# EAGLE design main (EAGLE 9.2.2)
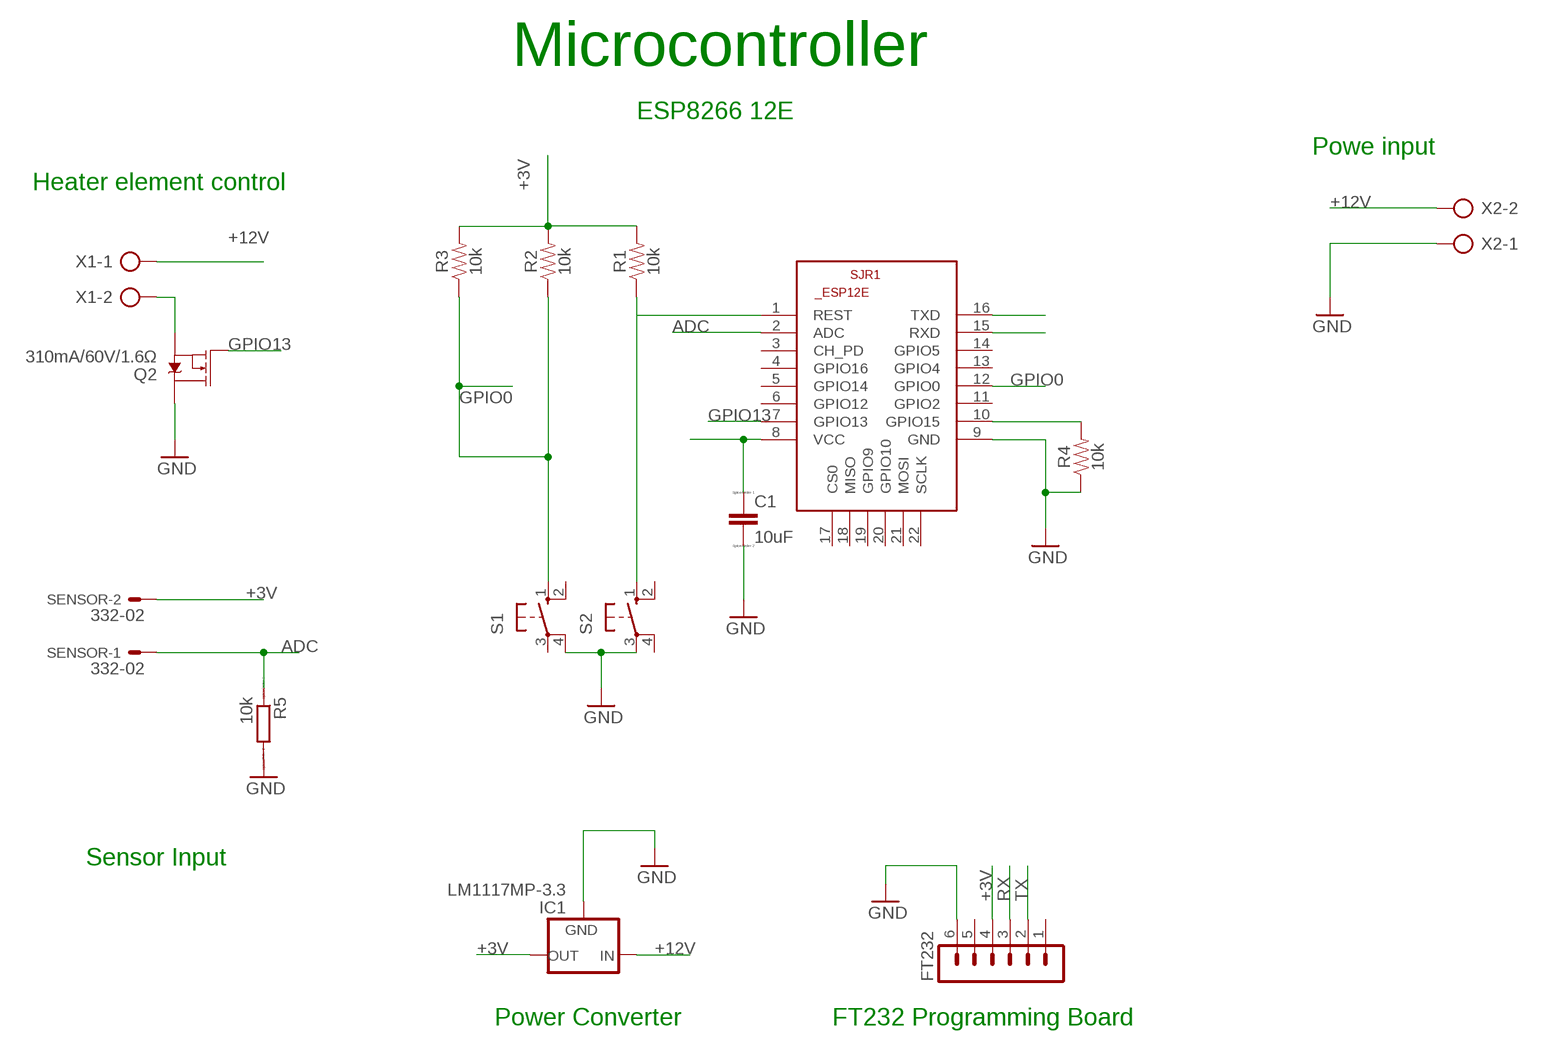
[diagram p0: schematic, sheet 1]

## Parts
C1  10uF  CC1206  [C1206]
FT232  MA06-1  [MA06-1]
IC1  LM1117MP-3.3  [SOT223]
Q2  310mA/60V/1.6Ω  MOSFET-NCH-2N7002PW  [SOT323]
R1  10k  10KOHM-0603-1/10W-1%  [0603]
R2  10k  10KOHM-0603-1/10W-1%  [0603]
R3  10k  10KOHM-0603-1/10W-1%  [0603]
R4  10k  10KOHM-0603-1/10W-1%  [0603]
R5  10k  RR1206  [R1206]
S1  10-XX  [B3F-10XX]
S2  10-XX  [B3F-10XX]
SENSOR  332-02  [332-02]
SJR1  ESP8266-12EESP12E  [ESP8266-ESP12E]
X1  AK500/2  [AK500/2]
X2  AK500/2  [AK500/2]

## Nets
+3V: C1.1 FT232.4 IC1.2(OUT) IC1.4(OUT) R1.2 R2.2 R3.2 SENSOR.2 SJR1.8(VCC)
+12V: IC1.3(IN) X1.1 X2.2
ADC: R5.1 SENSOR.1 SJR1.2(ADC)
GND: C1.2 FT232.6 IC1.1(GND) Q2.3(D) R4.1 R5.2 S1.4(P1) S2.3(P) SJR1.9(GND) X2.1
GPIO0: R2.1 R3.1 S1.1(S) SJR1.12(GPIO0)
GPIO13: Q2.1(G) SJR1.7(GPIO13)
N$1: Q2.2(S) X1.2
N$3: R1.1 S2.1(S) SJR1.1(REST)
N$5: R4.2 SJR1.10(GPIO15)
RX: FT232.3 SJR1.15(RXD)
TX: FT232.2 SJR1.16(TXD)
Unconnected: FT232.1 FT232.5 S1.2(S1) S1.3(P) S2.2(S1) S2.4(P1) SJR1.3(CH_PD) SJR1.4(GPIO16) SJR1.5(GPIO14) SJR1.6(GPIO12) SJR1.11(GPIO2) SJR1.13(GPIO4) SJR1.14(GPIO5) SJR1.17(CS0) SJR1.18(MISO) SJR1.19(GPIO9) SJR1.20(GPIO10) SJR1.21(MOSI) SJR1.22(SCLK)

## Notes on the sheet
- Microcontroller
- ESP8266 12E
- Powe input
- Heater element control
- Sensor Input
- Power Converter | FT232 Programming Board

## Library data of the parts
C1 = eagle-ltspice:C: CAPACITOR, European symbol; SPICEMODEL: NONE; SPICEPREFIX: C
FT232 = con-lstb:MA06-1: PIN HEADER; OC_FARNELL: unknown; OC_NEWARK: unknown
IC1 = lm1117_10:LM1117?-*: 800mA Low-Dropout Linear Regulator Source: http://www.ti.com/lit/ds/symlink/lm1117-n.pdf; MF: Texas Instruments; MPN: LM1117MP-3.3; OC_FARNELL: 9778195; OC_NEWARK: 28X3416
Q2 = SparkFun-DiscreteSemi:MOSFET-NCH: N-channel MOSFETs Voltage controlled devices that allow control of high current outputs. SparkFun Products: SparkFun OpenScale <https://www.sparkfun.com/products/13261> SparkFun Digital Sandbox <https://www.sparkfun.com/products/12651> SparkFun Monster Moto Shield <https://www.sparkfun.com/products/10182> SparkFun MOSFET Power Controller <https://www.sparkfun.com/products/11214>; PROD_ID: TRANS-11151
R1-R4 = SparkFun-Resistors:10KOHM: 10kΩ resistor A resistor is a passive two-terminal electrical component that implements electrical resistance as a circuit element. Resistors act to reduce current flow, and, at the same time, act to lower voltage levels within circuits. - Wikipedia; PROD_ID: RES-00824
R5 = eagle-ltspice:R: RESISTOR, European symbol; SPICEMODEL: NONE; SPICEPREFIX: R
S1 S2 = switch-omron:10-XX: OMRON SWITCH; MPN: B3F-1000; OC_FARNELL: 176432; OC_NEWARK: 36M3542
SENSOR = con-garry:332-02: 2 Pin - 2mm Dual Row Source: www.mpe-connector.de / garry_shortform_2012.pdf
SJR1 = esp12e:ESP8266-12E: ESP8266-12E Library for Eagle CAD The author not responsible for any damages or errors!. Created by Suhail jr.lt;/author>
X1 X2 = con-ptr500:AK500/2: CONNECTOR; OC_FARNELL: unknown; OC_NEWARK: unknown

## Board
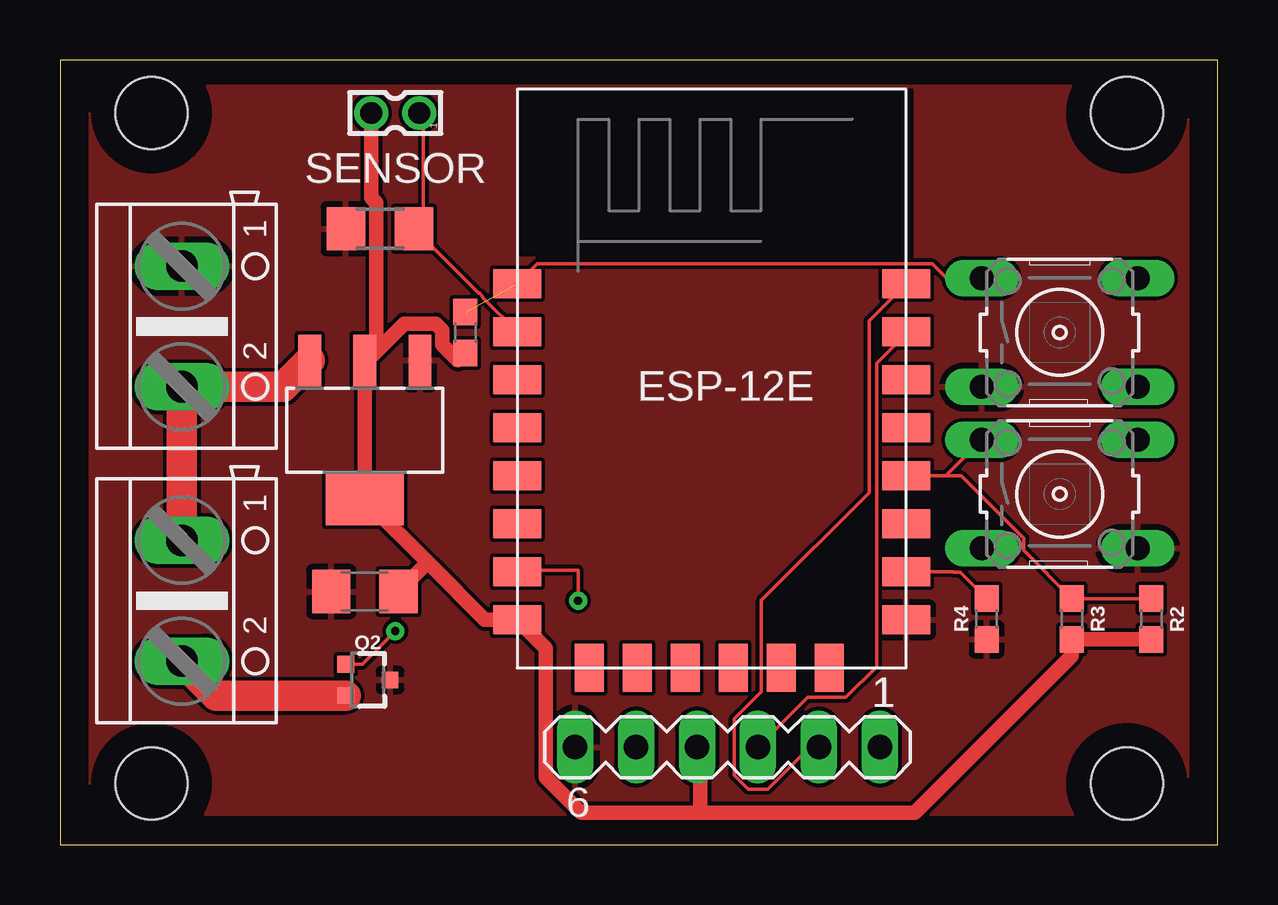
[diagram p1: board, top side]
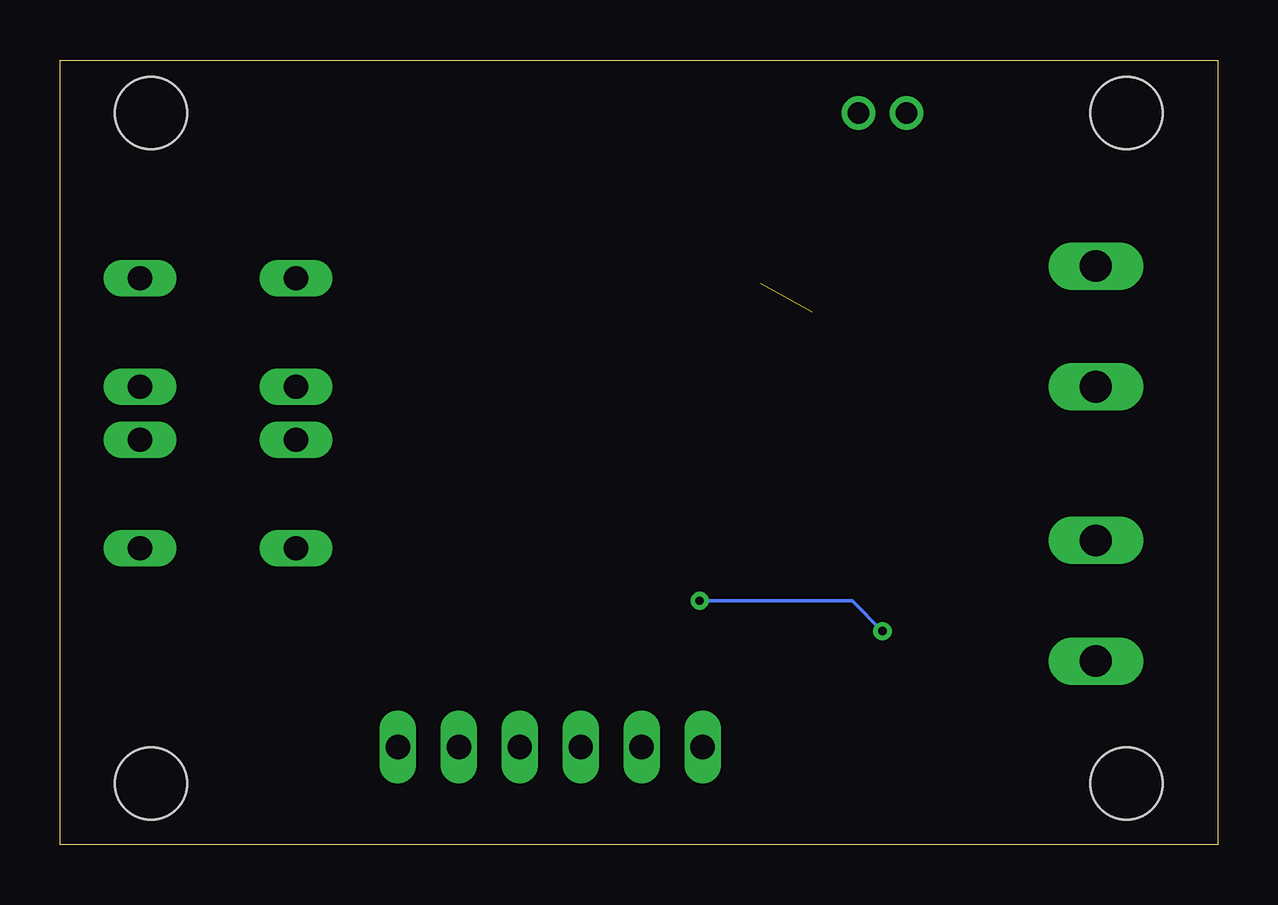
[diagram p2: board, bottom side, seen from below]

Size 48.24 x 32.69 mm. Coordinates in mm from the lower left corner, seen from the top.
Outline: 0,0 48.24,0 48.24,32.69 0,32.69 0,0
Copper layers (1*16): Top 0.035mm / dielectric 1.5mm / Bottom 0.035mm
Design rules "default": minimum track width 6mil, minimum drill 0.35mm, track to track 6mil, track to pad 6mil, pad to pad 6mil, via to via 6mil, smd to smd 6mil, copper to edge 40mil, drill to drill 6mil, minimum pad ring 10mil, minimum via ring 8mil, stop-mask expansion 4mil, vias tented up to drill 0mil, thermal gap 10mil
Holes 3 mm at 3.81,2.54 3.81,30.48 44.45,30.48 44.45,2.54

### Footprints (pad centres in the part's own frame; a part is rotated, then mirrored left to right if it is on the bottom)
C1206 = smd 1.6 x 1.8: 1 -1.4,0; 2 1.4,0
MA06-1 = drill 1.016 long: 1 -6.35,0; 2 -3.81,0; 3 -1.27,0; 4 1.27,0; 5 3.81,0; 6 6.35,0
SOT223 = smd 0.95 x 2.15: 1 -2.3,-2.9; 2 0,-2.9; 3 2.3,-2.9 | smd 3.25 x 2.15: 4 0,2.9
SOT323 = smd 0.7 x 0.7: 1 -0.65,-0.925; 2 0.65,-0.925; 3 0,0.925
0603 = smd 1.1 x 1: 1 -0.85,0; 2 0.85,0
R1206 = smd 1.6 x 1.803: 1 -1.422,0; 2 1.422,0
B3F-10XX = drill 1.016 long: 1 -3.251,2.261; 2 3.251,2.261; 3 -3.251,-2.261; 4 3.251,-2.261
332-02 = drill 0.9 pad 1.27: 1 0,-1; 2 0,1
ESP8266-ESP12E = smd 2 x 1.2: 1 -7.62,5.84; 2 -7.62,3.84; 3 -7.62,1.84; 4 -7.62,-0.16; 5 -7.62,-2.16; 6 -7.62,-4.16; 7 -7.62,-6.16; 8 -7.62,-8.16; 9 8.58,-8.16; 10 8.58,-6.16; 11 8.58,-4.16; 12 8.58,-2.16; 13 8.58,-0.16; 14 8.58,1.84; 15 8.58,3.84; 16 8.58,5.84 | smd 1.2 x 2: 17 -4.62,-10.16; 18 -2.62,-10.16; 19 -0.62,-10.16; 20 1.38,-10.16; 21 3.38,-10.16; 22 5.38,-10.16
AK500/2 = drill 1.321 long: 1 -2.515,0; 2 2.515,0

### Placement (x,y rotation side)
C1  12.7,10.54 180 top
FT232  27.81,4.06 180 top
IC1  12.7,17.27 180 top
Q2  12.83,6.86 270 top
R1  16.89,21.34 270 top
R2  45.47,9.4 270 top
R3  42.16,9.4 270 top
R4  38.61,9.4 90 top
R5  13.34,25.65 180 top
S1  41.66,14.61 0 top
S2  41.66,21.34 0 top
SENSOR  13.97,30.48 90 top
SJR1  26.67,17.53 0 top
X1  5.08,10.16 270 top
X2  5.08,21.59 270 top

### Tracks (layer width: path | path; a pad name or v marks a point on that pad's centre or on a via)
+3V
  Top 0.61: R1.2 16.58,20.17 15.93,20.82 15.93,21.44 15.66,21.7 14.34,21.7 13.17,20.54 | 15.44,11.63 IC1.4 IC1.2 12.8,20.17 13.17,20.54 | 15.44,11.63 17.71,9.37 SJR1.8 20.24,8.17 20.24,2.8 21.72,1.32 26.67,1.32 | C1.1 15.19,11.63 15.44,11.63 | R2.2 R3.2 42.16,7.87 35.61,1.32 26.67,1.32 | FT232.4 26.67,3.94 26.67,1.32 | SENSOR.2 12.97,26.95 13.17,26.75 13.17,20.54
+12V
  Top 1.27: IC1.3 9.3,19.07 X2.2 X1.1
ADC
  Top 0.152: SJR1.2 17.62,22.79 17.62,22.83 17.49,22.96 17.45,22.96 15.13,25.29 | R5.1 15.13,25.29 | SENSOR.1 15.13,30.32 15.13,25.29
GND
  pour Top: 1.27,2.54 2.54,1.27 45.72,1.27 46.99,2.54 46.99,30.48 45.72,31.75 2.54,31.75 1.27,30.48
GPIO0
  Top 0.152: S1.1 36.91,15.37 | 36.91,15.37 SJR1.12 | 36.91,15.37 37.55,15.37 40.16,12.76 40.16,12.26 R3.1 R2.1
GPIO13  (via drill 0.35)
  Top 0.152: Q2.1 12.59,7.51 v13.97,8.89 | v21.59,10.16 21.59,11.43 19.11,11.43 SJR1.7
  Bottom 0.152: v13.97,8.89 15.24,10.16 v21.59,10.16
N$1
  Top 1.27: X1.2 6.52,6.21 Q2.2
N$3  (1 unrouted)
  Top 0.152: S2.1 36.94,23.6 36.34,24.2 19.88,24.2 SJR1.1
N$5
  Top 0.152: R4.2 37.5,11.35 37.23,11.35 37.22,11.37 SJR1.10
RX
  Top 0.152: FT232.3 31.16,6.14 32.74,6.14 34.02,7.41 34.02,20.06 35.25,21.29 SJR1.15
TX
  Top 0.152: FT232.2 31.25,4.06 29.49,2.31 28.67,2.31 28.09,2.89 28.09,5.24 29.22,6.37 29.22,10.17 33.72,14.67 33.72,21.83 SJR1.16